# Altium schematic sheet MQBalanceAdapter.SchDoc
size A4
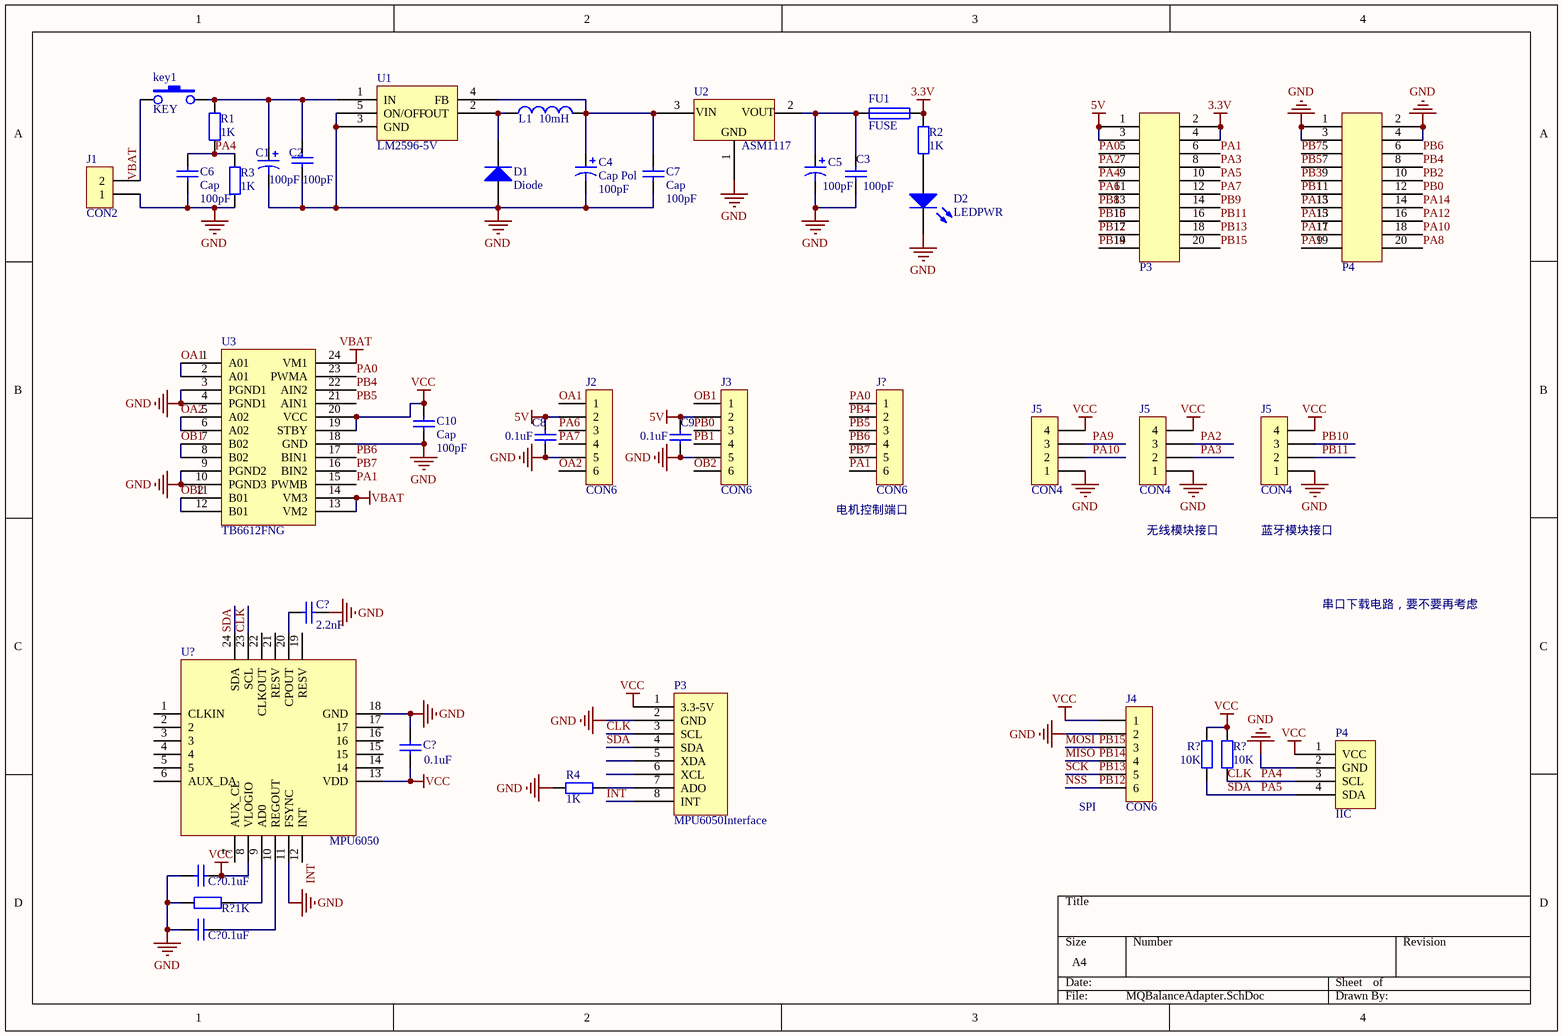
[diagram p0: MQBalanceAdapter.SchDoc]

## Parts
(Parts that share a designator on the sheet are numbered #1, #2 ... from top to bottom, then left to right.)
C1  value 100pF  (hidden comment: Cap Pol)
C2  value 100pF  (hidden comment: Cap)
C3  value 100pF  (hidden comment: Cap)
C4  Cap Pol  value 100pF
C5  value 100pF  (hidden comment: Cap Pol)
C6  Cap  value 100pF
C7  Cap  value 100pF
C8  value 0.1uF  (hidden comment: Cap)
C9  value 0.1uF  (hidden comment: Cap)
C10  Cap  value 100pF
C?#1  value 2.2nF  (hidden comment: Cap)
C?#2  value 0.1uF  (hidden comment: Cap)
C?#3  value 0.1uF  (hidden comment: Cap)
C?#4  value 0.1uF  (hidden comment: Cap)
D1  Diode
D2  LEDPWR
FU1  FUSE
J1  CON2
J2  CON6
J3  CON6
J4  CON6
J5#1  CON4
J5#2  CON4
J5#3  CON4
J?  CON6  [SIP6]
key1  KEY
L1  value 10mH  (hidden comment: Inductor)
P3#1  CON2X10  [SIP2x10]  (value not drawn)
P3#2  MPU6050Interface
P4#1  CON2X10  [SIP2x10]  (value not drawn)
P4#2  IIC
R1  value 1K  (hidden comment: Res)
R2  value 1K  (hidden comment: Res)
R3  value 1K  (hidden comment: Res)
R4  value 1K  (hidden comment: Res)
R?#1  value 10K  (hidden comment: Res)
R?#2  value 10K  (hidden comment: Res)
R?#3  value 1K  [0603R]  (hidden comment: Res)
U1  LM2596-5V
U2  ASM1117
U3  TB6612FNG
U?  MPU6050

## Nets
3.3V: FU1.2 P3#1.2 P3#1.4 R2.1
5V: C8.1 C9.1 J2.2 J3.2 P3#1.1 P3#1.3
GND: C1.2 C2.1 C3.1 C4.2 C5.2 C6.1 C7.1 C8.2 C9.2 C10.2 C?#1.1 C?#2.1 C?#3.1 C?#4.1 D1.1(A) D2.2(K) J1.1 J2.5 J3.5 J4.2 J5#1.1 J5#2.1 J5#3.1 P3#2.2(GND) P4#1.1 P4#1.2 P4#1.3 P4#1.4 P4#2.2(GND) R3.1 R4.1 R?#3.1 U1.3(GND) U1.5(ON/OFF) U2.1(GND) U3.3(PGND1) U3.4(PGND1) U3.9(PGND2) U3.10(PGND3) U3.18(GND) U?.11(FSYNC) U?.18(GND)
VBAT: J1.2 key1.1 U3.13(VM2) U3.14(VM3) U3.24(VM1)
VCC: C10.1 C?#2.2 C?#3.2 J4.1 J5#1.4 J5#2.4 J5#3.4 P3#2.1(3.3-5V) P4#2.1(VCC) R?#1.2 R?#2.2 U3.19(STBY) U3.20(VCC) U?.8(VLOGIO) U?.13(VDD)
CLK: C6.2 P3#1.9 P3#2.3(SCL) P4#2.3(SCL) R1.1 R3.2 R?#2.1 U?.23(SCL)  [also labelled PA4]
INT: P3#2.8(INT) U?.12(INT)
MISO: J4.4 P3#1.19  [also labelled PB14]
MOSI: J4.3 P3#1.20  [also labelled PB15]
NSS: J4.6 P3#1.17  [also labelled PB12]
OA1: J2.1 U3.1(A01) U3.2(A01)
OA2: J2.6 U3.5(A02) U3.6(A02)
OB1: J3.1 U3.7(B02) U3.8(B02)
OB2: J3.6 U3.11(B01) U3.12(B01)
PA0: J?.1 P3#1.5 U3.23(PWMA)
PA1: J?.6 P3#1.6 U3.15(PWMB)
PA2: J5#2.3 P3#1.7
PA3: J5#2.2 P3#1.8
PA5: P3#1.10 P3#2.4(SDA) P4#2.4(SDA) R?#1.1 U?.24(SDA)  [also labelled SDA]
PA6: J2.3 P3#1.11
PA7: J2.4 P3#1.12
PA8: P4#1.20
PA9: J5#1.3 P4#1.19
PA10: J5#1.2 P4#1.18
PA11: P4#1.17
PA12: P4#1.16
PA13: P4#1.15
PA14: P4#1.14
PA15: P4#1.13
PB0: J3.3 P4#1.12
PB1: J3.4 P4#1.11
PB2: P4#1.10
PB3: P4#1.9
PB4: J?.2 P4#1.8 U3.22(AIN2)
PB5: J?.3 P4#1.7 U3.21(AIN1)
PB6: J?.4 P4#1.6 U3.17(BIN1)
PB7: J?.5 P4#1.5 U3.16(BIN2)
PB8: P3#1.13
PB9: P3#1.14
PB10: J5#3.3 P3#1.15
PB11: J5#3.2 P3#1.16
PB13: J4.5 P3#1.18  [also labelled SCK]
NetC1_1: C1.1 C2.2 key1.2 R1.2 U1.1(IN)
NetC3_2: C3.2 C5.1 FU1.1 U2.2(VOUT)
NetC4_1: C4.1 C7.2 L1.2 U1.4(FB) U2.3(VIN)
NetC?#1_2: C?#1.2 U?.20(CPOUT)
NetC?#4_2: C?#4.2 U?.10(REGOUT)
NetD1_2: D1.2(K) L1.1 U1.2(OUT)
NetD2_1: D2.1(A) R2.2
NetP3#2_7: P3#2.7(ADO) R4.2
NetR?#3_2: R?#3.2 U?.9(AD0)

Not connected (* = marked no-connect by the designer): P3#2 5(XDA) 6(XCL); U? 1(CLKIN) 2 3 4 5 6(AUX_DA) 7(AUX_CL) 14 15 16 17 19(RESV) 21(RESV) 22(CLKOUT)

## Notes on the sheet
- (near J?) 电机控制端口
- 无线模块接口
- 蓝牙模块接口
- 串口下载电路，要不要再考虑
- (near J4) SPI

## Library data of the parts
C1 C4 C5 = Cap Pol: Polarized Capacitor (Axial); Published: 8-Jun-2000; LatestRevisionDate: 17-Jul-2002; LatestRevisionNote: Re-released for DXP Platform.; PackageReference: POLAR0.8; Publisher: Altium Limited
C2 C3 C6-C10 C?#1-C?#4 = Cap: Capacitor; Published: 8-Jun-2000; LatestRevisionDate: 17-Jul-2002; LatestRevisionNote: Re-released for DXP Platform.; PackageReference: RAD-0.3; Publisher: Altium Limited
D1 = Diode: Default Diode; Published: 8-Jun-2000; LatestRevisionDate: 17-Jul-2002; LatestRevisionNote: Re-released for DXP Platform.; PackageDocument: Sep-1996; PackageReference: SMC; Publisher: Altium Limited; Code_JEDEC: DO-214-AB
D2 = LED: Typical INFRARED GaAs LED; Published: 8-Jun-2000; LatestRevisionDate: 08-Jul-2005; LatestRevisionNote: Mech Layer 1 removed.; PackageReference: LED-0; Publisher: Altium Limited
L1 = Inductor: Code_IEC: 1005; Published: 8-Jun-2000; LatestRevisionDate: 17-Jul-2002; LatestRevisionNote: Re-released for DXP Platform.; PackageReference: 0402-A; Publisher: Altium Limited; Code_JEITA: 0402
P3#2 = MPU6050
R1-R4 R?#1-R?#3 = Res: Resistor
  R1-R4 R?#1 R?#2: Published: 8-Jun-2000; LatestRevisionDate: 17-Jul-2002; LatestRevisionNote: Re-released for DXP Platform.; PackageReference: AXIAL-0.4; Publisher: Altium Limited
U1 = LM2596
U3 = TB6612